# Altium schematic sheet NO.1 采集板.SchDoc: 石墨烯供电采集系统
size A2; Author: Yang Luo; CompanyName: Harbin Institute of Technology; SheetNumber: #01
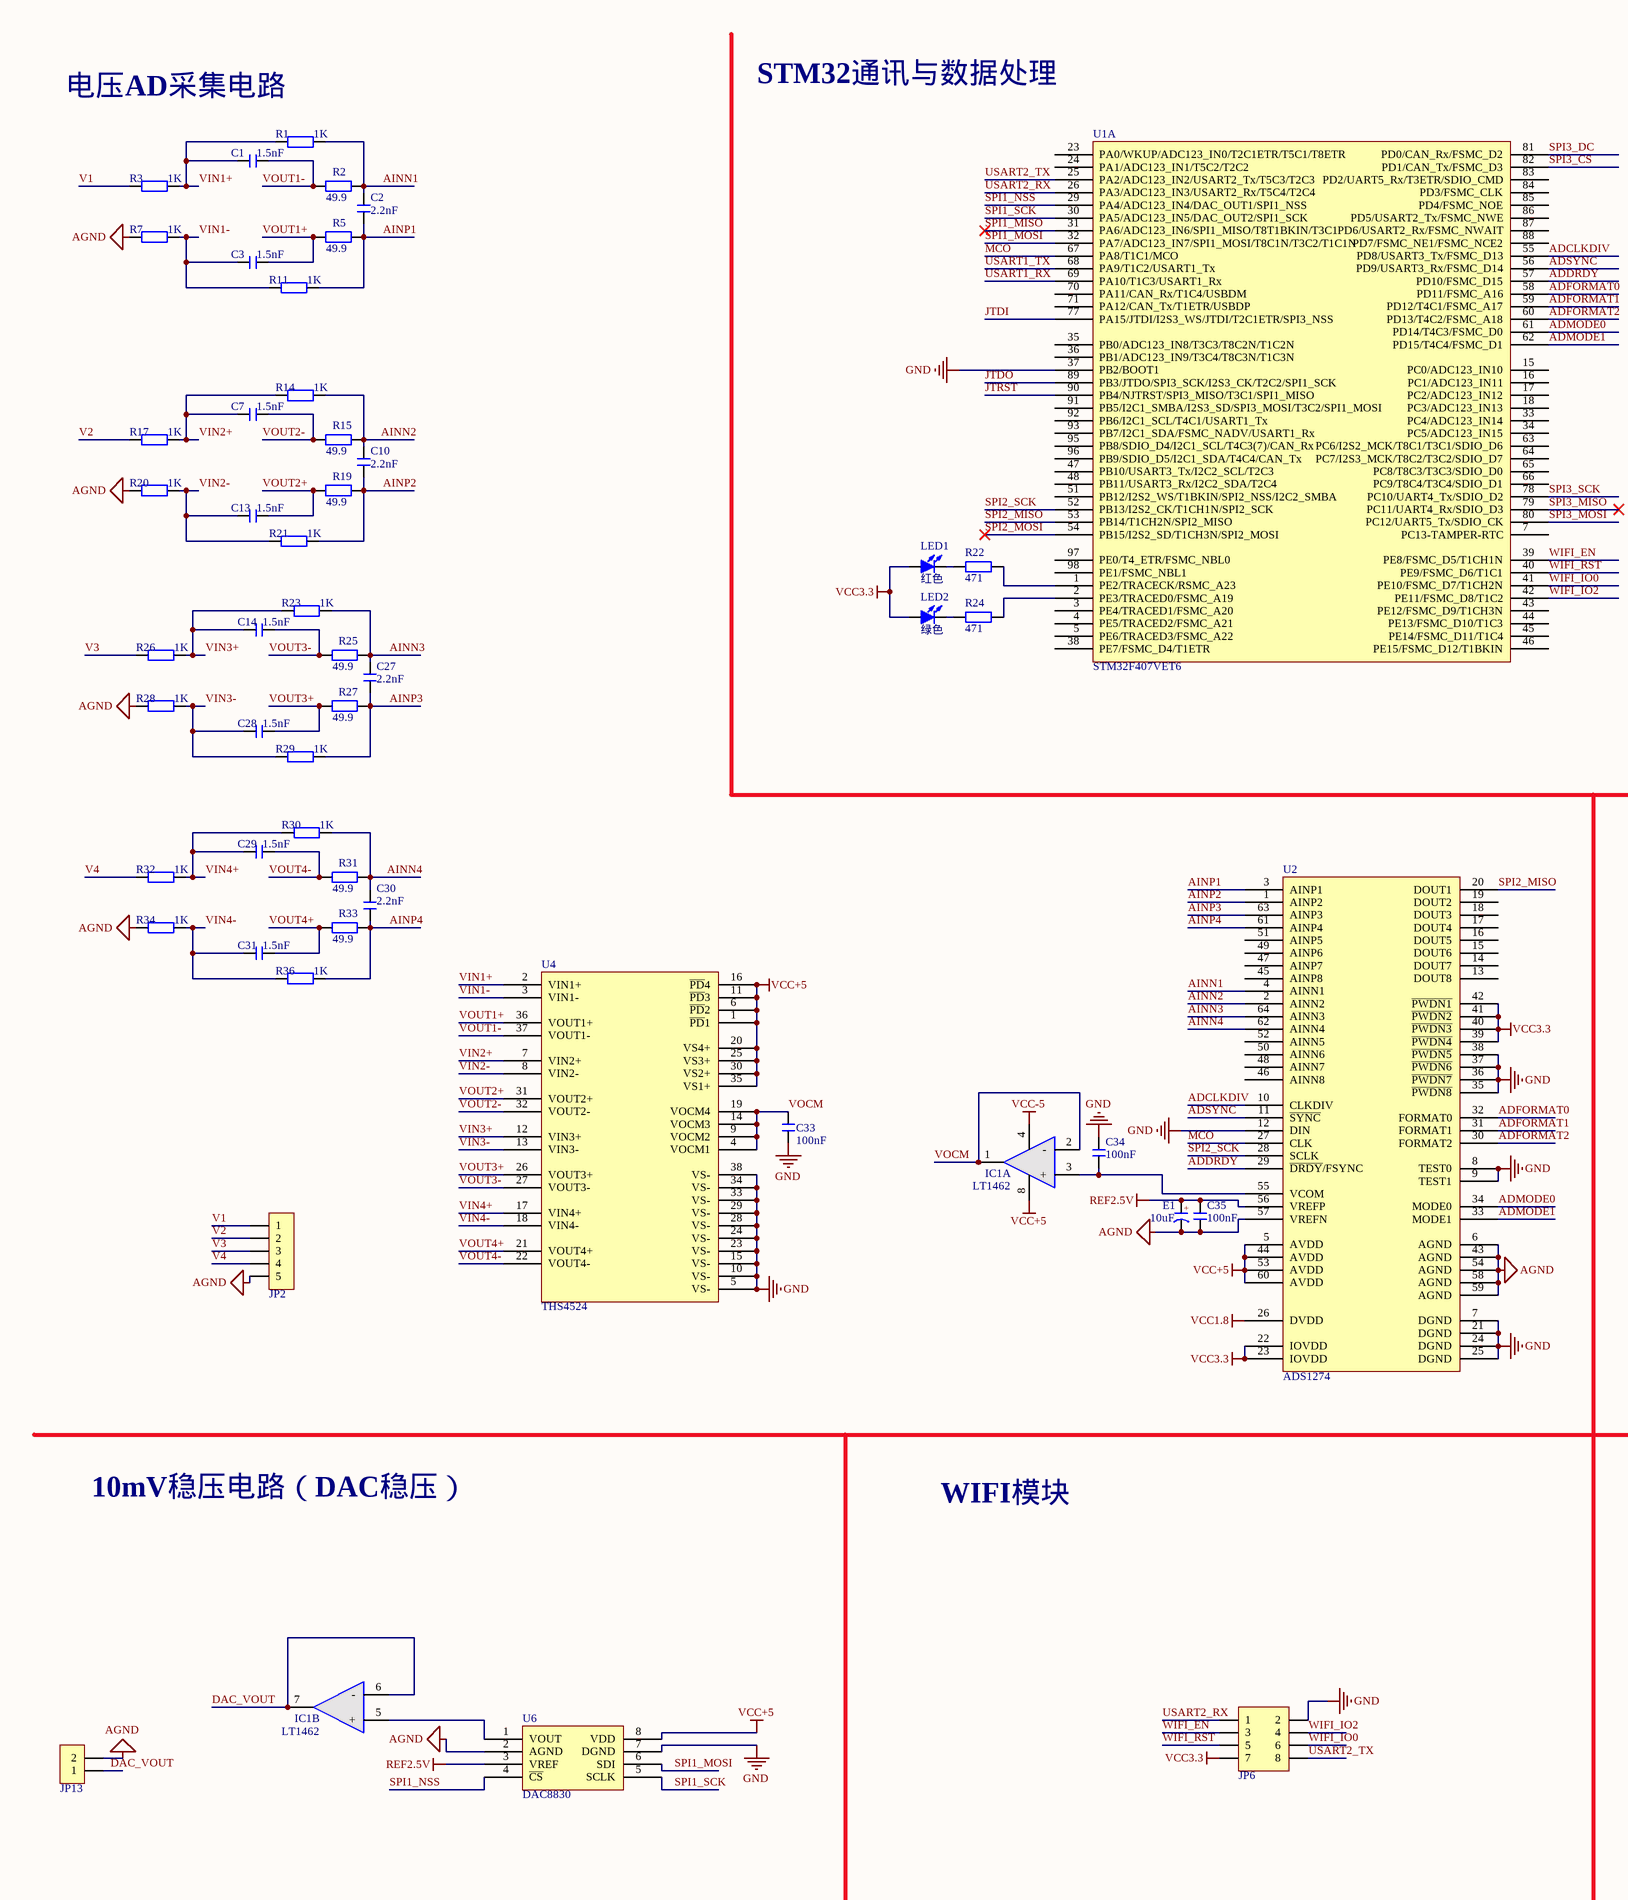
[diagram p0: NO.1 采集板.SchDoc, left]
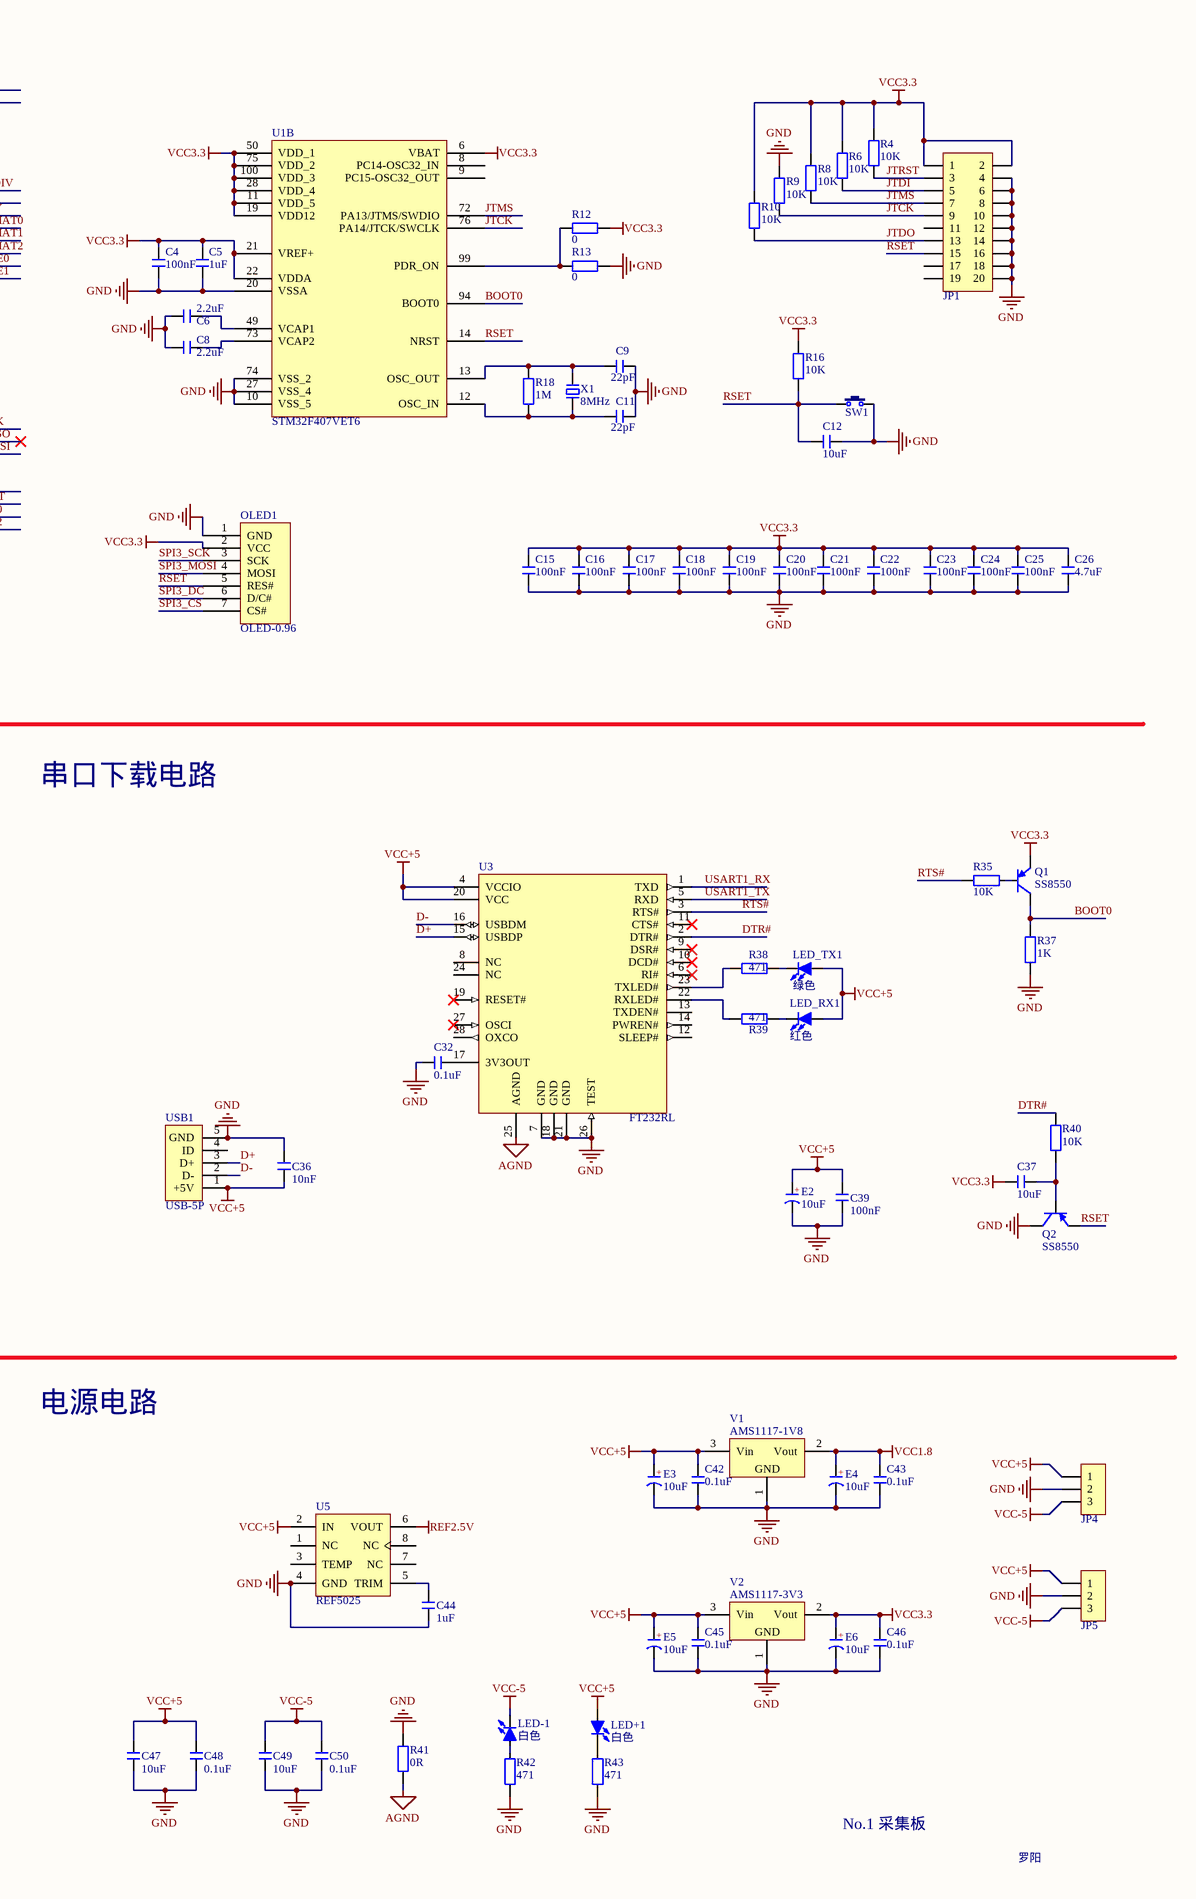
[diagram p1: NO.1 采集板.SchDoc, right]

## Parts
C1  1.5nF  [C 0805_M]
C2  2.2nF  [C 0805_M]
C3  1.5nF  [C 0805_M]
C4  100nF  [C 0805_M]
C5  1uF  [C 0805_M]
C6  2.2uF  [C 0805_M]
C7  1.5nF  [C 0805_M]
C8  2.2uF  [C 0805_M]
C9  22pF  [C 0805_M]
C10  2.2nF  [C 0805_M]
C11  22pF  [C 0805_M]
C12  10uF  [C 0805_M]
C13  1.5nF  [C 0805_M]
C14  1.5nF  [C 0805_M]
C15  100nF  [C 0805_M]
C16  100nF  [C 0805_M]
C17  100nF  [C 0805_M]
C18  100nF  [C 0805_M]
C19  100nF  [C 0805_M]
C20  100nF  [C 0805_M]
C21  100nF  [C 0805_M]
C22  100nF  [C 0805_M]
C23  100nF  [C 0805_M]
C24  100nF  [C 0805_M]
C25  100nF  [C 0805_M]
C26  4.7uF  [C 0805_M]
C27  2.2nF  [C 0805_M]
C28  1.5nF  [C 0805_M]
C29  1.5nF  [C 0805_M]
C30  2.2nF  [C 0805_M]
C31  1.5nF  [C 0805_M]
C32  0.1uF  [C 0805_M]
C33  100nF  [C 0805_M]
C34  100nF  [C 0805_M]
C35  100nF  [C 0805_M]
C36  10nF  [C 0805_M]
C37  10uF  [C 0805_M]
C39  100nF  [C 0805_M]
C42  0.1uF  [C 0805_M]
C43  0.1uF  [C 0805_M]
C44  1uF  [C 0805_M]
C45  0.1uF  [C 0805_M]
C46  0.1uF  [C 0805_M]
C47  10uF  [C 0805_M]
C48  0.1uF  [C 0805_M]
C49  10uF  [C 0805_M]
C50  0.1uF  [C 0805_M]
E1  10uF  [CD A(3216)]
E2  10uF  [CD A(3216)]
E3  10uF  [CD A(3216)]
E4  10uF  [CD A(3216)]
E5  10uF  [CD A(3216)]
E6  10uF  [CD A(3216)]
IC1  LT1462  [SOP8_N]  (parts A,B of 2)
JP1  Header 2X10  [IDC2.54-LI-2x10P]  (value not drawn)
JP2  HDR-1X5  [XH2.54-WI-5P]  (value not drawn)
JP4  HDR-1X3  [XH2.54-WI-3P]  (value not drawn)
JP5  HDR-1X3  [XH2.54-WI-3P]  (value not drawn)
JP6  Header 4X2  [HDR2.54-LI-2x4P]  (value not drawn)
JP13  HDR-1X2  [XH2.54-WI-2P]  (value not drawn)
LED1  红色  [LED 0805R]
LED2  绿色  [LED 0805G]
LED+1  白色  [LED 0805W]
LED-1  白色  [LED 0805W]
LED_RX1  红色  [LED 0805R]
LED_TX1  绿色  [LED 0805G]
OLED1  OLED-0.96  [OLED]
Q1  SS8550  [SOT23-3M]
Q2  SS8550  [SOT23-3M]
R1  1K  [R 0805_M]
R2  49.9  [R 0805_M]
R3  1K  [R 0805_M]
R4  10K  [R 0805_M]
R5  49.9  [R 0805_M]
R6  10K  [R 0805_M]
R7  1K  [R 0805_M]
R8  10K  [R 0805_M]
R9  10K  [R 0805_M]
R10  10K  [R 0805_M]
R11  1K  [R 0805_M]
R12  0  [R 0805_M]
R13  0  [R 0805_M]
R14  1K  [R 0805_M]
R15  49.9  [R 0805_M]
R16  10K  [R 0805_M]
R17  1K  [R 0805_M]
R18  1M  [R 0805_M]
R19  49.9  [R 0805_M]
R20  1K  [R 0805_M]
R21  1K  [R 0805_M]
R22  471  [R 0805_M]
R23  1K  [R 0805_M]
R24  471  [R 0805_M]
R25  49.9  [R 0805_M]
R26  1K  [R 0805_M]
R27  49.9  [R 0805_M]
R28  1K  [R 0805_M]
R29  1K  [R 0805_M]
R30  1K  [R 0805_M]
R31  49.9  [R 0805_M]
R32  1K  [R 0805_M]
R33  49.9  [R 0805_M]
R34  1K  [R 0805_M]
R35  10K  [R 0805_M]
R36  1K  [R 0805_M]
R37  1K  [R 0805_M]
R38  471  [R 0805_M]
R39  471  [R 0805_M]
R40  10K  [R 0805_M]
R41  0R  [R 0805_M]
R42  471  [R 0805_M]
R43  471  [R 0805_M]
SW1  3x6x5  [TSW SMD-3*6*2.5]  (value not drawn)
U1  STM32F407VET6  [LQFP-100_M]  (parts A,B of 2)
U2  ADS1274  [TQFP64-10*10]
U3  FT232RL  [SSOP28_N]
U4  THS4524  [TSSOP-38 - duplicate]
U5  REF5025  [SOP8_M]
U6  DAC8830  [SOP8]
USB1  USB-5P  [USB-MICRO_D]
V1  AMS1117-1V8  [SOT223_M]
V2  AMS1117-3V3  [SOT223_M]
X1  8MHz  [OSC HC-49S]

## Nets
AGND: C35.1 E1.2(K) JP2.5 JP13.2 R7.1 R20.1 R28.1 R34.1 R41.1 U2.6(AGND) U2.43(AGND) U2.54(AGND) U2.57(VREFN) U2.58(AGND) U2.59(AGND) U3.25(AGND) U6.2(AGND)
GND: C4.1 C5.1 C6.2 C8.2 C9.2 C11.1 C12.2 C15.1 C16.1 C17.1 C18.1 C19.1 C20.1 C21.1 C22.1 C23.1 C24.1 C25.1 C26.1 C32.2 C33.2 C34.2 C36.1 C39.2 C42.1 C43.1 C44.1 C45.1 C46.1 C47.1 C48.1 C49.1 C50.1 E2.2(K) E3.2(K) E4.2(K) E5.2(K) E6.2(K) JP1.4 JP1.6 JP1.8 JP1.10 JP1.12 JP1.14 JP1.16 JP1.18 JP1.20 JP4.2 JP5.2 JP6.2 OLED1.1(GND) Q2.3(C) R9.1 R13.1 R37.1 R41.2 R42.2 R43.2 SW1.2 U1.10(VSS_5) U1.20(VSSA) U1.27(VSS_4) U1.37(PB2/BOOT1) U1.74(VSS_2) U2.7(DGND) U2.8(TEST0) U2.9(TEST1) U2.12(DIN) U2.21(DGND) U2.24(DGND) U2.25(DGND) U2.35(~{PWDN8}) U2.36(~{PWDN7}) U2.37(~{PWDN6}) U2.38(~{PWDN5}) U3.7(GND) U3.18(GND) U3.21(GND) U3.26(TEST) U4.5(VS-) U4.10(VS-) U4.15(VS-) U4.23(VS-) U4.24(VS-) U4.28(VS-) U4.29(VS-) U4.33(VS-) U4.34(VS-) U4.38(VS-) U5.4(GND) U6.7(DGND) USB1.5(GND) V1.1(GND) V2.1(GND)
REF2.5V: C35.2 E1.1(A) U2.56(VREFP) U5.6(VOUT) U6.3(VREF)
VCC1.8: C43.2 E4.1(A) U2.26(DVDD) V1.2(Vout)
VCC3.3: C4.2 C5.2 C15.2 C16.2 C17.2 C18.2 C19.2 C20.2 C21.2 C22.2 C23.2 C24.2 C25.2 C26.2 C37.2 C46.2 E6.1(A) JP1.1 JP1.2 JP6.7 LED1.1(A) LED2.1(A) OLED1.2(VCC) Q1.2(E) R4.1 R6.1 R8.1 R10.1 R12.1 R16.2 U1.6(VBAT) U1.11(VDD_5) U1.19(VDD12) U1.21(VREF+) U1.22(VDDA) U1.28(VDD_4) U1.50(VDD_1) U1.75(VDD_2) U1.100(VDD_3) U2.22(IOVDD) U2.23(IOVDD) U2.39(~{PWDN4}) U2.40(~{PWDN3}) U2.41(~{PWDN2}) U2.42(~{PWDN1}) V2.2(Vout)
VCC+5: C36.2 C39.1 C42.2 C45.2 C47.2 C48.2 E2.1(A) E3.1(A) E5.1(A) IC1.8(V+) JP4.1 JP5.1 LED+1.1(A) LED_RX1.1(A) LED_TX1.1(A) U2.5(AVDD) U2.44(AVDD) U2.53(AVDD) U2.60(AVDD) U3.4(VCCIO) U3.20(VCC) U4.1(~{PD}1) U4.6(~{PD}2) U4.11(~{PD}3) U4.16(~{PD}4) U4.20(VS4+) U4.25(VS3+) U4.30(VS2+) U4.35(VS1+) U5.2(IN) U6.8(VDD) USB1.1(+5V) V1.3(Vin) V2.3(Vin)
VCC-5: C49.2 C50.2 IC1.4(V-) JP4.3 JP5.3 LED-1.2(K)
ADCLKDIV: U1.55(PD8/USART3_Tx/FSMC_D13) U2.10(CLKDIV)
ADDRDY: U1.57(PD10/FSMC_D15) U2.29(~{DRDY}/FSYNC)
ADFORMAT0: U1.58(PD11/FSMC_A16) U2.32(FORMAT0)
ADFORMAT1: U1.59(PD12/T4C1/FSMC_A17) U2.31(FORMAT1)
ADFORMAT2: U1.60(PD13/T4C2/FSMC_A18) U2.30(FORMAT2)
ADMODE0: U1.61(PD14/T4C3/FSMC_D0) U2.34(MODE0)
ADMODE1: U1.62(PD15/T4C4/FSMC_D1) U2.33(MODE1)
ADSYNC: U1.56(PD9/USART3_Rx/FSMC_D14) U2.11(~{SYNC})
AINN1: C2.1 R1.2 R2.2 U2.4(AINN1)
AINN2: C10.1 R14.2 R15.2 U2.2(AINN2)
AINN3: C27.1 R23.2 R25.2 U2.64(AINN3)
AINN4: C30.1 R30.2 R31.2 U2.62(AINN4)
AINP1: C2.2 R5.2 R11.2 U2.3(AINP1)
AINP2: C10.2 R19.2 R21.2 U2.1(AINP2)
AINP3: C27.2 R27.2 R29.2 U2.63(AINP3)
AINP4: C30.2 R33.2 R36.2 U2.61(AINP4)
BOOT0: Q1.3(C) R37.2 U1.94(BOOT0)
D+: U3.15(USBDP) USB1.3(D+)
D-: U3.16(USBDM) USB1.2(D-)
DAC_VOUT: IC1.6(-) IC1.7(OUT2) JP13.1
DTR#: R40.2 U3.2(DTR#)
JTCK: JP1.9 R9.2 U1.76(PA14/JTCK/SWCLK)
JTDI: JP1.5 R6.2 U1.77(PA15/JTDI/I2S3_WS/JTDI/T2C1ETR/SPI3_NSS)
JTDO: JP1.13 R10.2 U1.89(PB3/JTDO/SPI3_SCK/I2S3_CK/T2C2/SPI1_SCK)
JTMS: JP1.7 R8.2 U1.72(PA13/JTMS/SWDIO)
JTRST: JP1.3 R4.2 U1.90(PB4/NJTRST/SPI3_MISO/T3C1/SPI1_MISO)
MCO: U1.67(PA8/T1C1/MCO) U2.27(CLK)
RSET: C12.1 JP1.15 OLED1.5(RES#) Q2.2(E) R16.1 SW1.1 U1.14(NRST)
RTS#: R35.1 U3.3(RTS#)
SPI1_MISO: U1.31(PA6/ADC123_IN6/SPI1_MISO/T8T1BKIN/T3C1)
SPI1_MOSI: U1.32(PA7/ADC123_IN7/SPI1_MOSI/T8C1N/T3C2/T1C1N) U6.6(SDI)
SPI1_NSS: U1.29(PA4/ADC123_IN4/DAC_OUT1/SPI1_NSS) U6.4(~{CS})
SPI1_SCK: U1.30(PA5/ADC123_IN5/DAC_OUT2/SPI1_SCK) U6.5(SCLK)
SPI2_MISO: U1.53(PB14/T1CH2N/SPI2_MISO) U2.20(DOUT1)
SPI2_MOSI: U1.54(PB15/I2S2_SD/T1CH3N/SPI2_MOSI)
SPI2_SCK: U1.52(PB13/I2S2_CK/T1CH1N/SPI2_SCK) U2.28(SCLK)
SPI3_CS: OLED1.7(CS#) U1.82(PD1/CAN_Tx/FSMC_D3)
SPI3_DC: OLED1.6(D/C#) U1.81(PD0/CAN_Rx/FSMC_D2)
SPI3_MISO: U1.79(PC11/UART4_Rx/SDIO_D3)
SPI3_MOSI: OLED1.4(MOSI) U1.80(PC12/UART5_Tx/SDIO_CK)
SPI3_SCK: OLED1.3(SCK) U1.78(PC10/UART4_Tx/SDIO_D2)
USART1_RX: U1.69(PA10/T1C3/USART1_Rx) U3.1(TXD)
USART1_TX: U1.68(PA9/T1C2/USART1_Tx) U3.5(RXD)
USART2_RX: JP6.1 U1.26(PA3/ADC123_IN3/USART2_Rx/T5C4/T2C4)
USART2_TX: JP6.8 U1.25(PA2/ADC123_IN2/USART2_Tx/T5C3/T2C3)
V1: JP2.1 R3.1
V2: JP2.2 R17.1
V3: JP2.3 R26.1
V4: JP2.4 R32.1
VIN1+: C1.2 R1.1 R3.2 U4.2(VIN1+)
VIN1-: C3.2 R7.2 R11.1 U4.3(VIN1-)
VIN2+: C7.2 R14.1 R17.2 U4.7(VIN2+)
VIN2-: C13.2 R20.2 R21.1 U4.8(VIN2-)
VIN3+: C14.2 R23.1 R26.2 U4.12(VIN3+)
VIN3-: C28.2 R28.2 R29.1 U4.13(VIN3-)
VIN4+: C29.2 R30.1 R32.2 U4.17(VIN4+)
VIN4-: C31.2 R34.2 R36.1 U4.18(VIN4-)
VOCM: C33.1 IC1.1(OUT1) IC1.2(-) U4.4(VOCM1) U4.9(VOCM2) U4.14(VOCM3) U4.19(VOCM4)
VOUT1+: C3.1 R5.1 U4.36(VOUT1+)
VOUT1-: C1.1 R2.1 U4.37(VOUT1-)
VOUT2+: C13.1 R19.1 U4.31(VOUT2+)
VOUT2-: C7.1 R15.1 U4.32(VOUT2-)
VOUT3+: C28.1 R27.1 U4.26(VOUT3+)
VOUT3-: C14.1 R25.1 U4.27(VOUT3-)
VOUT4+: C31.1 R33.1 U4.21(VOUT4+)
VOUT4-: C29.1 R31.1 U4.22(VOUT4-)
WIFI_EN: JP6.3 U1.39(PE8/FSMC_D5/T1CH1N)
WIFI_IO0: JP6.6 U1.41(PE10/FSMC_D7/T1CH2N)
WIFI_IO2: JP6.4 U1.42(PE11/FSMC_D8/T1C2)
WIFI_RST: JP6.5 U1.40(PE9/FSMC_D6/T1C1)
NetC6_1: C6.1 U1.49(VCAP1)
NetC8_1: C8.1 U1.73(VCAP2)
NetC9_1: C9.1 R18.1 U1.13(OSC_OUT) X1.1
NetC11_2: C11.2 R18.2 U1.12(OSC_IN) X1.2
NetC32_1: C32.1 U3.17(3V3OUT)
NetC34_1: C34.1 IC1.3(+) U2.55(VCOM)
NetC37_1: C37.1 Q2.1(B) R40.1
NetC44_2: C44.2 U5.5(TRIM)
NetIC1_5: IC1.5(+) U6.1(VOUT)
NetLED1_2: LED1.2(K) R22.1
NetLED2_2: LED2.2(K) R24.1
NetLED+1_2: LED+1.2(K) R43.1
NetLED-1_1: LED-1.1(A) R42.1
NetLED_RX1_2: LED_RX1.2(K) R39.1
NetLED_TX1_2: LED_TX1.2(K) R38.1
NetQ1_1: Q1.1(B) R35.2
NetR12_2: R12.2 R13.2 U1.99(PDR_ON)
NetR22_2: R22.2 U1.1(PE2/TRACECK/RSMC_A23)
NetR24_2: R24.2 U1.2(PE3/TRACED0/FSMC_A19)
NetR38_2: R38.2 U3.23(TXLED#)
NetR39_2: R39.2 U3.22(RXLED#)

Not connected (* = marked no-connect by the designer): JP1 11 17 19; U1 3(PE4/TRACED1/FSMC_A20) 4(PE5/TRACED2/FSMC_A21) 5(PE6/TRACED3/FSMC_A22) 7(PC13-TAMPER-RTC) 8(PC14-OSC32_IN) 9(PC15-OSC32_OUT) 15(PC0/ADC123_IN10) 16(PC1/ADC123_IN11) 17(PC2/ADC123_IN12) 18(PC3/ADC123_IN13) 23(PA0/WKUP/ADC123_IN0/T2C1ETR/T5C1/T8ETR) 24(PA1/ADC123_IN1/T5C2/T2C2) 33(PC4/ADC123_IN14) 34(PC5/ADC123_IN15) 35(PB0/ADC123_IN8/T3C3/T8C2N/T1C2N) 36(PB1/ADC123_IN9/T3C4/T8C3N/T1C3N) 38(PE7/FSMC_D4/T1ETR) 43(PE12/FSMC_D9/T1CH3N) 44(PE13/FSMC_D10/T1C3) 45(PE14/FSMC_D11/T1C4) 46(PE15/FSMC_D12/T1BKIN) 47(PB10/USART3_Tx/I2C2_SCL/T2C3) 48(PB11/USART3_Rx/I2C2_SDA/T2C4) 51(PB12/I2S2_WS/T1BKIN/SPI2_NSS/I2C2_SMBA) 63(PC6/I2S2_MCK/T8C1/T3C1/SDIO_D6) 64(PC7/I2S3_MCK/T8C2/T3C2/SDIO_D7) 65(PC8/T8C3/T3C3/SDIO_D0) 66(PC9/T8C4/T3C4/SDIO_D1) 70(PA11/CAN_Rx/T1C4/USBDM) 71(PA12/CAN_Tx/T1ETR/USBDP) 83(PD2/UART5_Rx/T3ETR/SDIO_CMD) 84(PD3/FSMC_CLK) 85(PD4/FSMC_NOE) 86(PD5/USART2_Tx/FSMC_NWE) 87(PD6/USART2_Rx/FSMC_NWAIT) 88(PD7/FSMC_NE1/FSMC_NCE2) 91(PB5/I2C1_SMBA/I2S3_SD/SPI3_MOSI/T3C2/SPI1_MOSI) 92(PB6/I2C1_SCL/T4C1/USART1_Tx) 93(PB7/I2C1_SDA/FSMC_NADV/USART1_Rx) 95(PB8/SDIO_D4/I2C1_SCL/T4C3(7)/CAN_Rx) 96(PB9/SDIO_D5/I2C1_SDA/T4C4/CAN_Tx) 97(PE0/T4_ETR/FSMC_NBL0) 98(PE1/FSMC_NBL1); U2 13(DOUT8) 14(DOUT7) 15(DOUT6) 16(DOUT5) 17(DOUT4) 18(DOUT3) 19(DOUT2) 45(AINP8) 46(AINN8) 47(AINP7) 48(AINN7) 49(AINP6) 50(AINN6) 51(AINP5) 52(AINN5); U3 6(RI#)* 8(NC) 9(DSR#)* 10(DCD#)* 11(CTS#)* 12(SLEEP#) 13(TXDEN#) 14(PWREN#) 19(RESET#)* 24(NC) 27(OSCI)* 28(OXCO); U5 1(NC) 3(TEMP) 7(NC) 8(NC); USB1 4(ID)

## Notes on the sheet
- 电压AD采集电路
- STM32通讯与数据处理
- 串口下载电路
- 10mV稳压电路（DAC稳压）
- WIFI模块
- 电源电路
- No.1 采集板
- 罗阳
- (in symbol C-CD) +
- (in symbol C-CM) +

## Library data of the parts
C1-C37 C39 C42-C50 = C: 无极性贴片电容; 版权归属: 源创客; BOM名称: 无极性贴片电容; 学习资源: www.ooocke.com
E1 E3-E6 = C-CD: 贴片钽电容; 版权归属: 源创客; BOM名称: 贴片钽电容; 学习资源: www.ooocke.com
E2 = C-CM: 贴片电解电容; 版权归属: 源创客; BOM名称: 贴片电解电容; 学习资源: www.ooocke.com
IC1 = LT1678: 双运放; 版权归属: 源创客; BOM名称: 双运放; 学习资源: www.ooocke.com
JP1 = Header 10X2: 10*2P接插件; 版权归属: 源创客; BOM名称: 10*2P接插件; 学习资源: www.ooocke.com
JP2 = Header 5: 5P接插件; 版权归属: 源创客; BOM名称: 5P接插件; 学习资源: www.ooocke.com
JP4 JP5 = Header 3: 3P接插件; 版权归属: 源创客; BOM名称: 3P接插件; 学习资源: www.ooocke.com
JP6 = Header 4X2: 4*2P接插件; 版权归属: 源创客; BOM名称: 4*2P接插件; 学习资源: www.ooocke.com
JP13 = Header 2: 2P接插件; 版权归属: 源创客; BOM名称: 2P接插件; 学习资源: www.ooocke.com
LED1 LED2 LED+1 LED-1 LED_RX1 LED_TX1 = LED-SMD: 贴片LED; 版权归属: 源创客; BOM名称: 贴片LED; 学习资源: www.ooocke.com
Q1 Q2 = 8550-SMD: 高频放大-PNP型; 版权归属: 源创客; 属性: 40V 1.5A 1W 100MHZ; BOM名称: 高频放大-PNP型; 学习资源: www.ooocke.com
R1-R43 = R: 贴片电阻; 版权归属: 源创客; BOM名称: 贴片电阻; 学习资源: www.ooocke.com
SW1 = TSW 3x6: 3x6轻触开关; 版权归属: 源创客; BOM名称: 3x6轻触开关; 学习资源: www.ooocke.com
U1 = STM32F407V: STM32单片机100引脚
U2 = ADS1274/ADS1278
U3 = FT232RL: USB转串口; 版权归属: 源创客; BOM名称: USB转串口; 学习资源: www.ooocke.com
U5 = REF5040: 高精度电压基准; 版权归属: 源创客; BOM名称: 高精度电压基准; 学习资源: www.ooocke.com
USB1 = USB-5P: 微型USB母座; 版权归属: 源创客; BOM名称: 微型USB母座; 学习资源: www.ooocke.com
V1 V2 = AMS1117: 三端稳压芯片; BOM名称: 稳压芯片; 版权归属: 源创客; 学习资源: www.ooocke.com
X1 = XTAL-2P: 2脚无源脚晶振; 版权归属: 源创客; BOM名称: 2脚无源脚晶振; 学习资源: www.ooocke.com